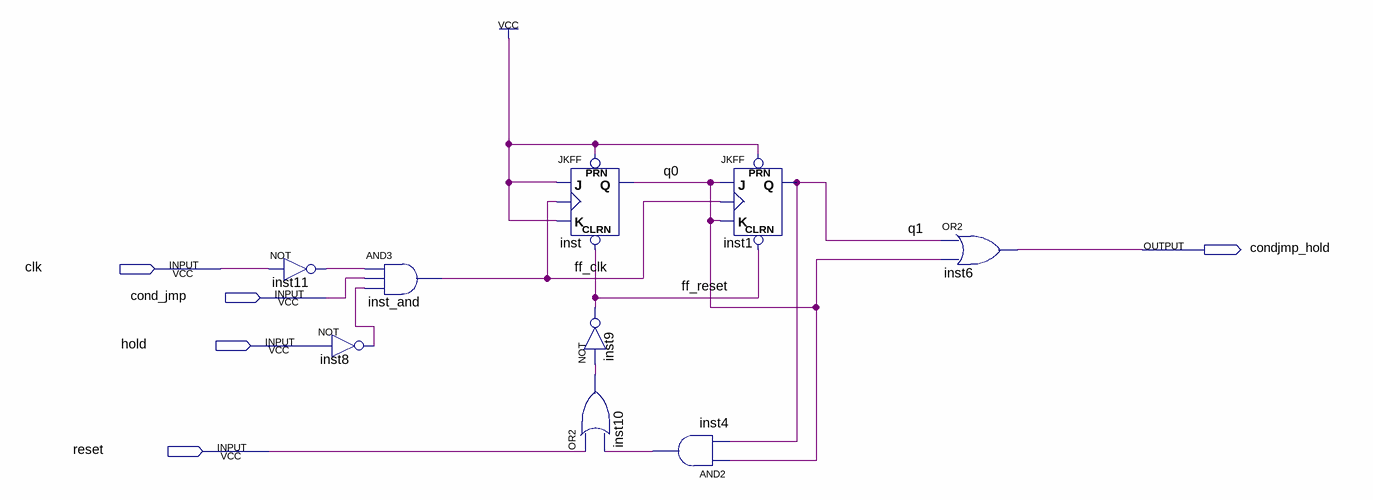
[diagram p0: schematic sheet]
// Quartus schematic uc_cjmp.bdf as structural Verilog: 9 symbols, 5 pins
module uc_cjmp (
  input  clk,
  input  cond_jmp,
  input  hold,
  input  reset,
  output condjmp_hold
);

  wire ff_clk, ff_reset, inst4_out, inst8_out, inst10_out, inst11_out, q0, q1;

  not inst11 (inst11_out, clk);
  not inst8 (inst8_out, hold);
  and inst_and (ff_clk, inst11_out, cond_jmp, inst8_out);
  JKFF inst (.PRN(1'b1), .CLRN(ff_reset), .K(1'b1), .J(1'b1), .CLK(ff_clk), .Q(q0));
  not inst9 (ff_reset, inst10_out);
  or inst10 (inst10_out, reset, inst4_out);
  and inst4 (inst4_out, q0, q1);
  JKFF inst1 (.PRN(1'b1), .CLRN(ff_reset), .K(q0), .J(q0), .CLK(ff_clk), .Q(q1));
  or inst6 (condjmp_hold, q1, q0);
endmodule
